# EAGLE design final_board (EAGLE 9.6.2)
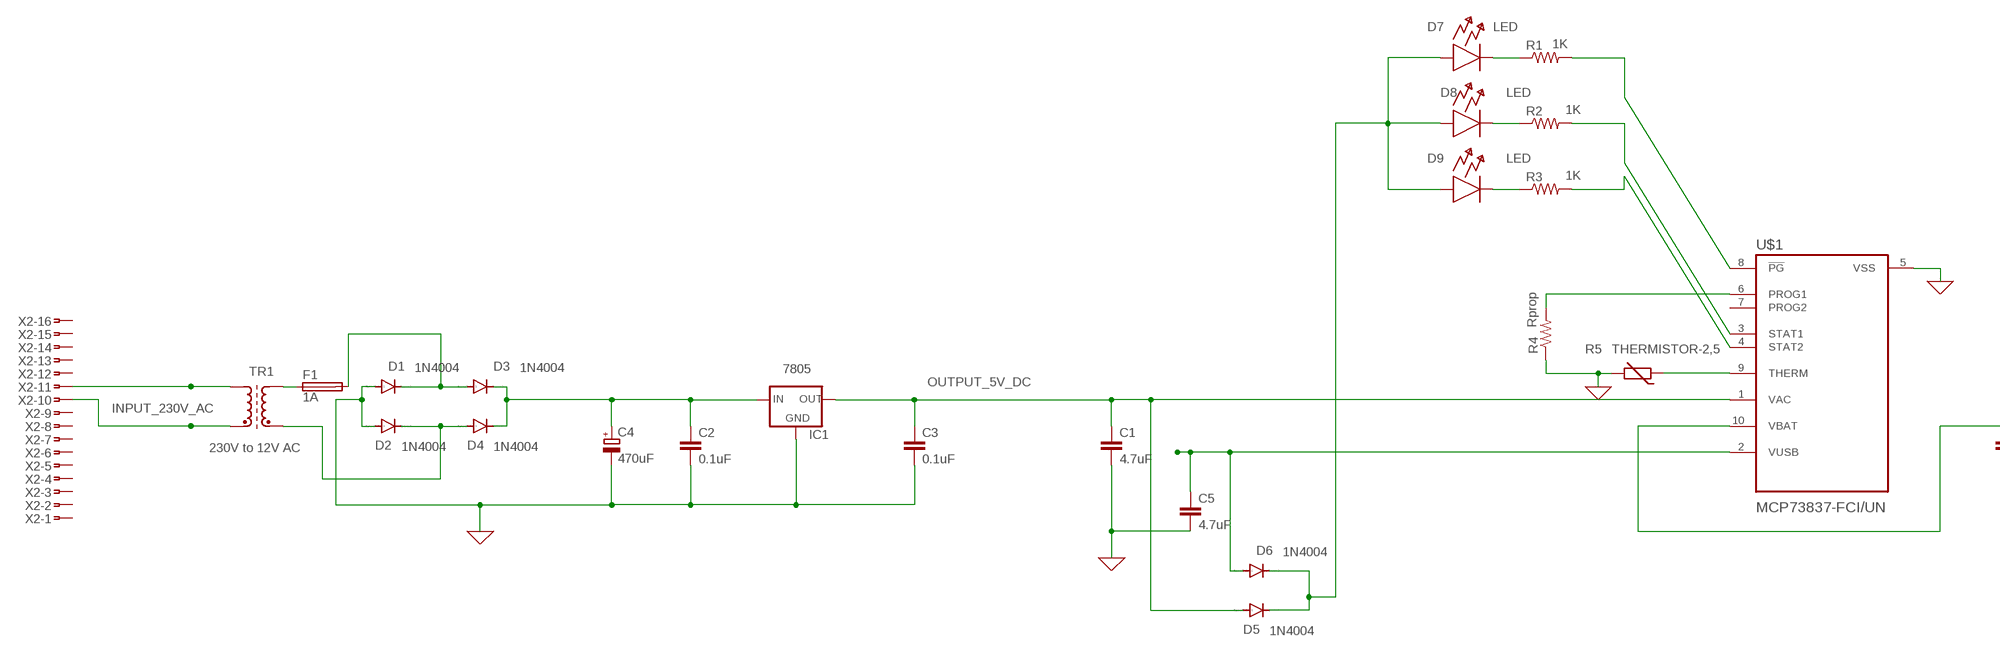
[diagram p0: schematic, sheet 1, part 1 of 2]
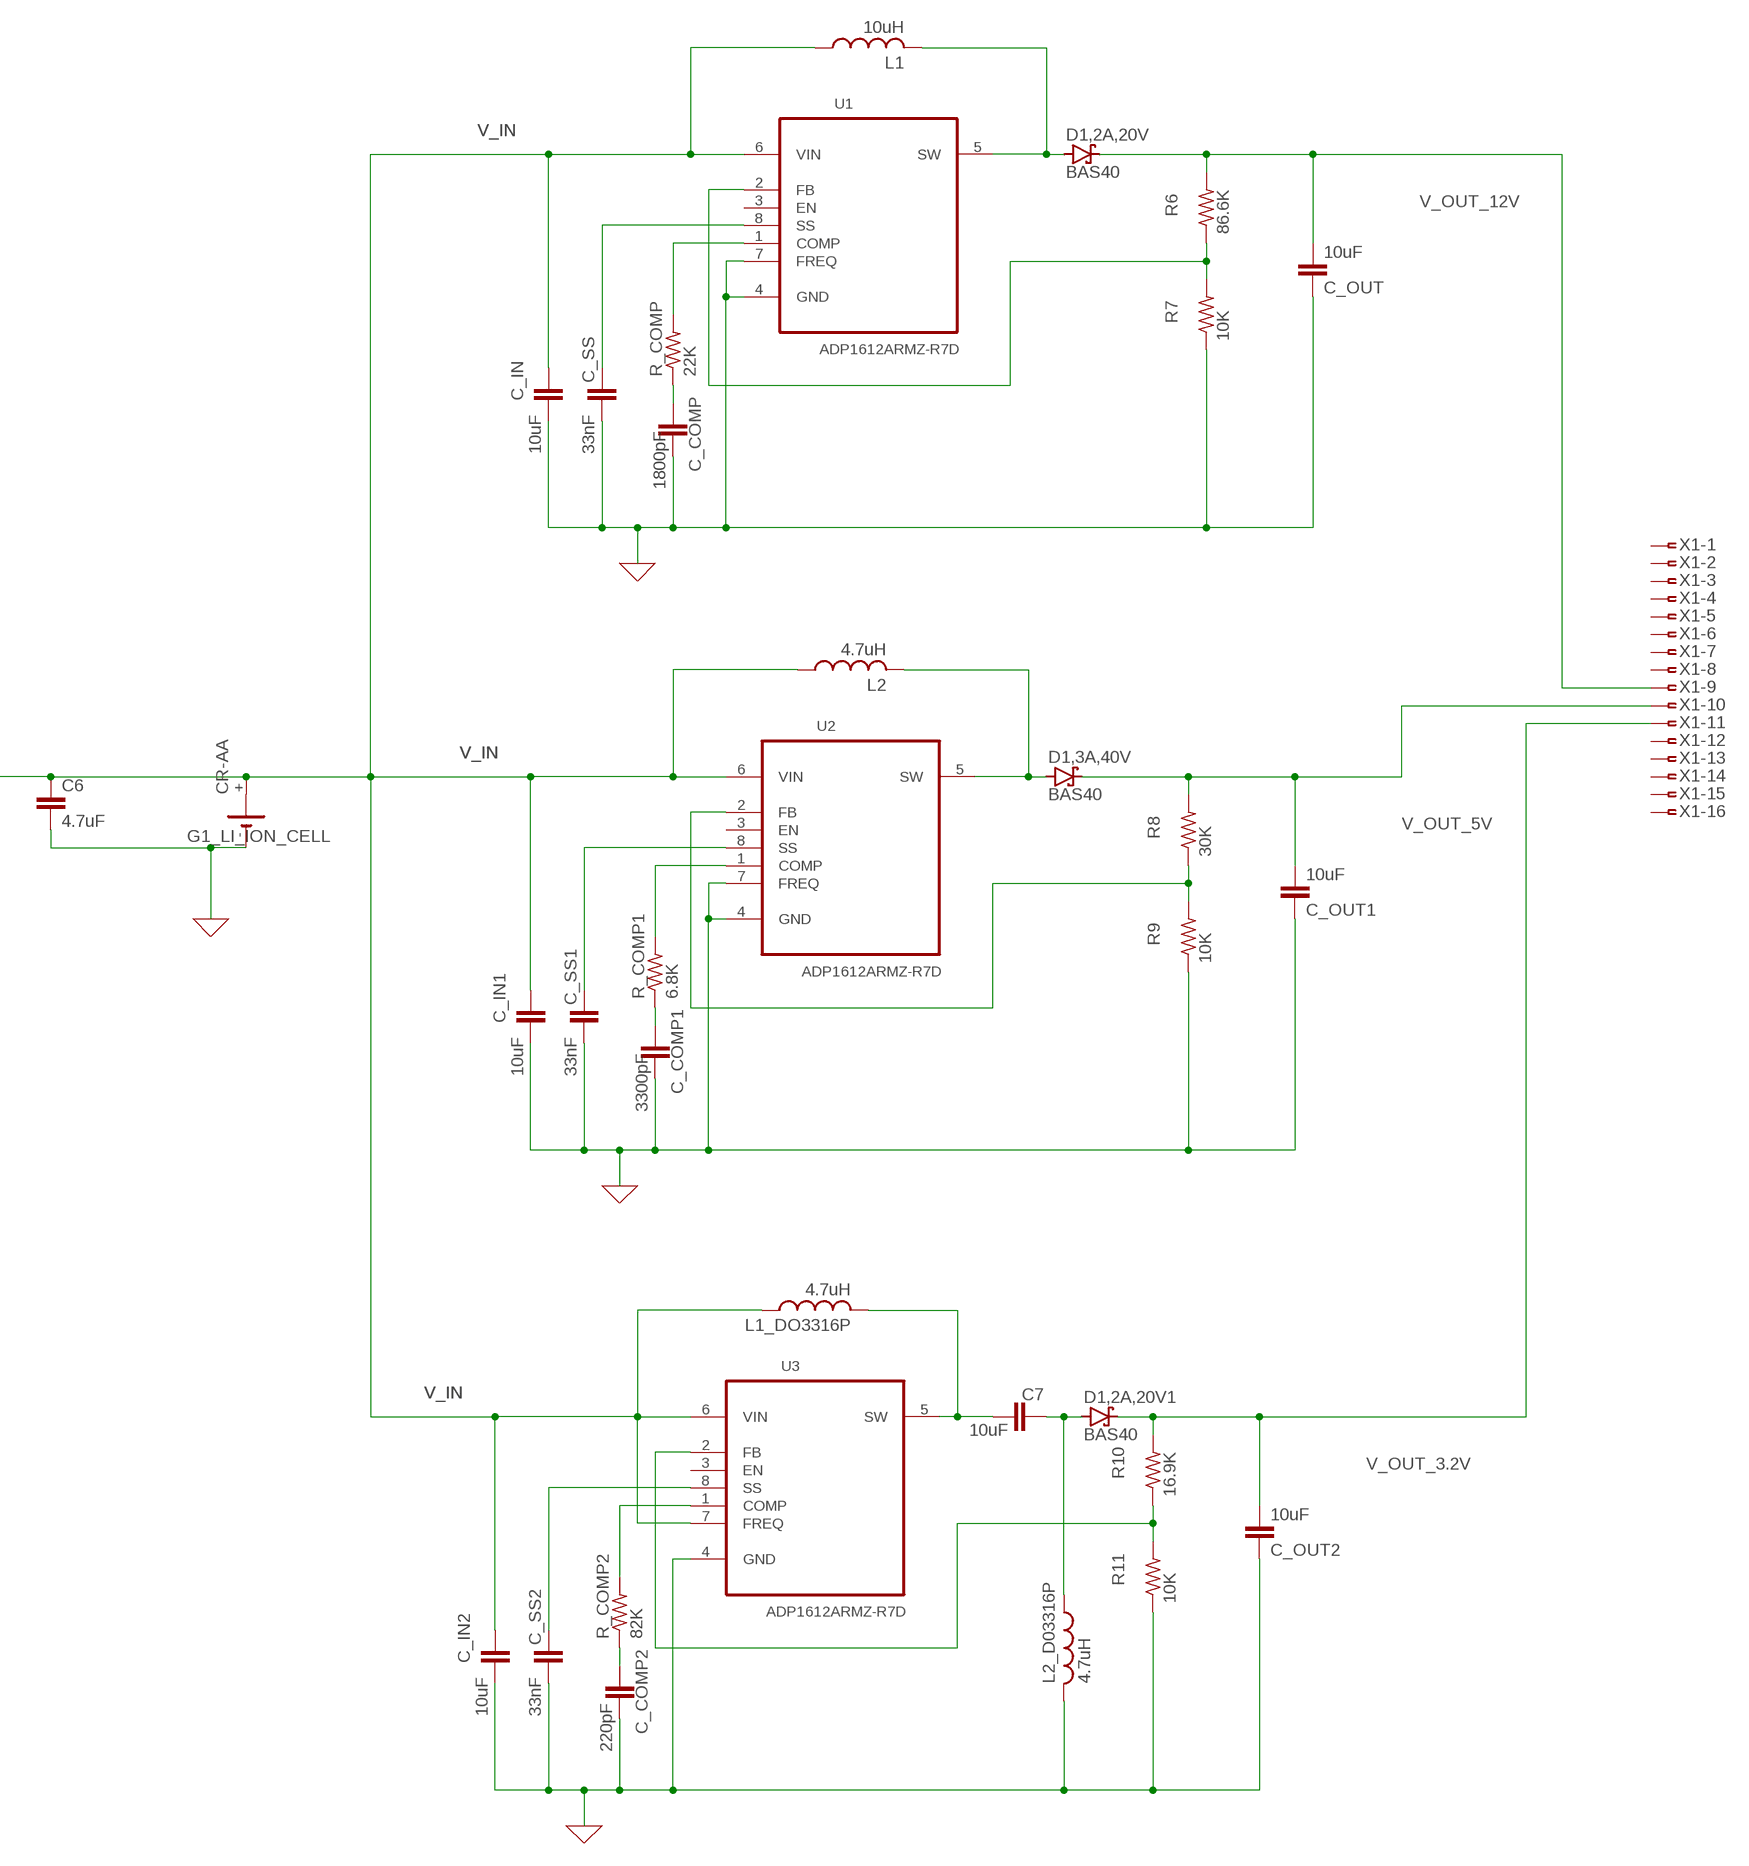
[diagram p1: schematic, sheet 1, part 2 of 2]

## Parts
C1  4.7uF  C2,5-3  [C2.5-3]
C2  0.1uF  C2,5-3  [C2.5-3]
C3  0.1uF  C2,5-3  [C2.5-3]
C4  470uF  CPOL-EU085CS-1AR  [085CS_1AR]
C5  4.7uF  C2,5-3  [C2.5-3]
C6  4.7uF  C2,5-3  [C2.5-3]
C7  10uF  C2,5-3  [C2.5-3]
C_COMP  1800pF  C2,5-3  [C2.5-3]
C_COMP1  3300pF  C2,5-3  [C2.5-3]
C_COMP2  220pF  C2,5-3  [C2.5-3]
C_IN  10uF  C2,5-3  [C2.5-3]
C_IN1  10uF  C2,5-3  [C2.5-3]
C_IN2  10uF  C2,5-3  [C2.5-3]
C_OUT  10uF  C2,5-3  [C2.5-3]
C_OUT1  10uF  C2,5-3  [C2.5-3]
C_OUT2  10uF  C2,5-3  [C2.5-3]
C_SS  33nF  C2,5-3  [C2.5-3]
C_SS1  33nF  C2,5-3  [C2.5-3]
C_SS2  33nF  C2,5-3  [C2.5-3]
D1  1N4004  [DO41-10]
D1,2A,20V  BAS40  [SOT23]
D1,2A,20V1  BAS40  [SOT23]
D1,3A,40V  BAS40  [SOT23]
D2  1N4004  [DO41-10]
D3  1N4004  [DO41-10]
D4  1N4004  [DO41-10]
D5  1N4004  [DO41-10]
D6  1N4004  [DO41-10]
D7  LED  (no package)
D8  LED  (no package)
D9  LED  (no package)
F1  1A  19559  [19559]
G1_LI_ION_CELL  CR-AA  [CRAA]
IC1  7805  78XXL  [78XXL]
L1  10uH  L-US0204/5  [0204/5]
L1_DO3316P  4.7uH  L-US0204/5  [0204/5]
L2  4.7uH  L-US0204/5  [0204/5]
L2_D03316P  4.7uH  L-US0204/5  [0204/5]
R1  1K  R-US_0204/2V  [0204V]
R2  1K  R-US_0204/2V  [0204V]
R3  1K  R-US_0204/2V  [0204V]
R4  Rprop  R-US_0204/2V  [0204V]
R5  THERMISTOR-2,5  [RS-2,5]
R6  86.6K  R-US_0204/7  [0204/7]
R7  10K  R-US_0204/7  [0204/7]
R8  30K  R-US_0204/7  [0204/7]
R9  10K  R-US_0204/7  [0204/7]
R10  16.9K  R-US_0204/7  [0204/7]
R11  10K  R-US_0204/7  [0204/7]
R_COMP  22K  R-US_0204/7  [0204/7]
R_COMP1  6.8K  R-US_0204/7  [0204/7]
R_COMP2  82K  R-US_0204/7  [0204/7]
TR1  230V to 12V AC  SM-T4  [SM-T4]
U1  ADP1612ARMZ-R7D  [SOIC-08]
U2  ADP1612ARMZ-R7D  [SOIC-08]
U3  ADP1612ARMZ-R7D  [SOIC-08]
U$1  MCP73837-FCI/UN  [SOP50P490X110-10N]
X1  FSIDE-16  [FSIDE-16]
X2  FSIDE-16  [FSIDE-16]

## Nets
0: C1.2 C2.2 C3.2 C4.- C5.2 C6.2 C_COMP1.2 C_COMP2.2 C_COMP.2 C_IN1.2 C_IN2.2 C_IN.2 C_OUT1.2 C_OUT2.2 C_OUT.2 C_SS1.2 C_SS2.2 C_SS.2 D1.A D2.A G1_LI_ION_CELL.- IC1.GND L2_D03316P.2 R4.1 R5.2 R7.1 R9.1 R11.1 U1.4(GND) U1.7(FREQ) U2.4(GND) U2.7(FREQ) U3.4(GND) U$1.5(VSS) ; supply symbol labelled GND
INPUT_230V_AC: TR1.1(A1) X2.11
N$2: TR1.2(E1) X2.10
N$3: C5.1 D6.A U$1.2(VUSB)
N$4: D1.C D3.A F1.2
N$5: D2.C D4.A TR1.4(E2)
N$6: C2.1 C4.+ D3.C D4.C IC1.IN
N$7: F1.1 TR1.5(A2)
N$8: D7.C R1.1
N$9: D8.C R2.1
N$10: D9.C R3.1
N$11: R1.2 U$1.8(!PG)
N$12: R2.2 U$1.3(STAT1)
N$13: R3.2 U$1.4(STAT2)
N$14: R5.1 U$1.9(THERM)
N$15: R4.2 U$1.6(PROG1)
N$16: D5.C D6.C D7.A D8.A D9.A
N$18: D1,2A,20V.1(A) L1.2 U1.5(SW)
N$19: C_COMP.1 R_COMP.1
N$20: R_COMP.2 U1.1(COMP)
N$21: C_SS.1 U1.8(SS)
N$22: R6.1 R7.2 U1.2(FB)
N$23: D1,3A,40V.1(A) L2.2 U2.5(SW)
N$24: C_COMP1.1 R_COMP1.1
N$25: R_COMP1.2 U2.1(COMP)
N$26: C_SS1.1 U2.8(SS)
N$27: R8.1 R9.2 U2.2(FB)
N$28: C7.1 L1_DO3316P.2 U3.5(SW)
N$29: C_COMP2.1 R_COMP2.1
N$30: R_COMP2.2 U3.1(COMP)
N$31: C_SS2.1 U3.8(SS)
N$32: R10.1 R11.2 U3.2(FB)
N$33: C7.2 D1,2A,20V1.1(A) L2_D03316P.1
OUTPUT_5V_DC: C1.1 C3.1 D5.A IC1.OUT U$1.1(VAC)
V_IN: C6.1 C_IN1.1 C_IN2.1 C_IN.1 G1_LI_ION_CELL.+ L1.1 L1_DO3316P.1 L2.1 U1.6(VIN) U2.6(VIN) U3.6(VIN) U3.7(FREQ) U$1.10(VBAT)
V_OUT_3.2V: C_OUT2.1 D1,2A,20V1.3(C) R10.2 X1.11
V_OUT_5V: C_OUT1.1 D1,3A,40V.3(C) R8.2 X1.10
V_OUT_12V: C_OUT.1 D1,2A,20V.3(C) R6.2 X1.9
Unconnected: G1_LI_ION_CELL.+@1(+) U1.3(EN) U2.3(EN) U3.3(EN) U$1.7(PROG2) X1.1 X1.2 X1.3 X1.4 X1.5 X1.6 X1.7 X1.8 X1.12 X1.13 X1.14 X1.15 X1.16 X2.1 X2.2 X2.3 X2.4 X2.5 X2.6 X2.7 X2.8 X2.9 X2.12 X2.13 X2.14 X2.15 X2.16

## Library data of the parts
C1-C3 C5-C7 C_COMP C_COMP1 C_COMP2 C_IN C_IN1 C_IN2 C_OUT C_OUT1 C_OUT2 C_SS C_SS1 C_SS2 = capacitor-wima:C: CAPACITOR naming: grid - package width
C4 = rcl:CPOL-EU: POLARIZED CAPACITOR, European symbol; SPICEPREFIX: C
D1-D6 = diode:1N4004: DIODE general purpose rectifier, 1 A
D1,2A,20V D1,2A,20V1 D1,3A,40V = diode:BAS40: Silicon Schottky Diodes General-purpose diode for high-speed switching
D7-D9 = ngspice-simulation:LED: Diode
F1 = fuse:19559: FUSE HOLDER TR5, Wickmann; MPN: 55900000001; OC_FARNELL: 9516360; OC_NEWARK: 02P0286
G1_LI_ION_CELL = battery:CR-AA: LI BATTERY Varta CRAA-SLF
IC1 = v-reg:78XXL: VOLTAGE REGULATOR
L1 L1_DO3316P L2 L2_D03316P = rcl:L-US: INDUCTOR, American symbol; SPICEPREFIX: L
R1-R4 R6-R11 R_COMP R_COMP1 R_COMP2 = rcl:R-US_: RESISTOR, American symbol; SPICEPREFIX: R
R5 = varistor:THERMISTOR: THERMISTOR
TR1 = inductor-neosid:SM-T4: TRANSFORMER SMD wideband transformer; OC_FARNELL: unknown; OC_NEWARK: unknown
U1-U3 = ADP1612ARMZ-R7:ADP1612ARMZ-R7: Step-Up PWM DC-to-DC Switching Converters; AVAILABILITY: Unavailable; DESCRIPTION: Boost, SEPIC Switching Regulator IC Positive Adjustable 1.8V 1 Output 1.4A (Switch) 8-TSSOP, 8-MSOP (0.118, 3.00mm Width); MF: Analog Devices; MP: ADP1612ARMZ-R7; PACKAGE: MSOP-8 Analog Devices; PRICE: None
U$1 = MCP73837-FCI_UN:MCP73837-FCI/UN: Check prices <https://pricing.snapeda.com/search/part/MCP73837-FCI/UN/?ref=eda>; AVAILABILITY: Warning; DESCRIPTION: Charger IC Lithium Ion/Polymer 10-MSOP; MF: Microchip; MP: MCP73837-FCI/UN; PACKAGE: MSOP-10 Microchip; PRICE: None; PURCHASE-URL: https://pricing.snapeda.com/search/part/MCP73837-FCI/UN/?ref=eda
X1 X2 = con-amp:FSIDE-16: AMP connector

## Board
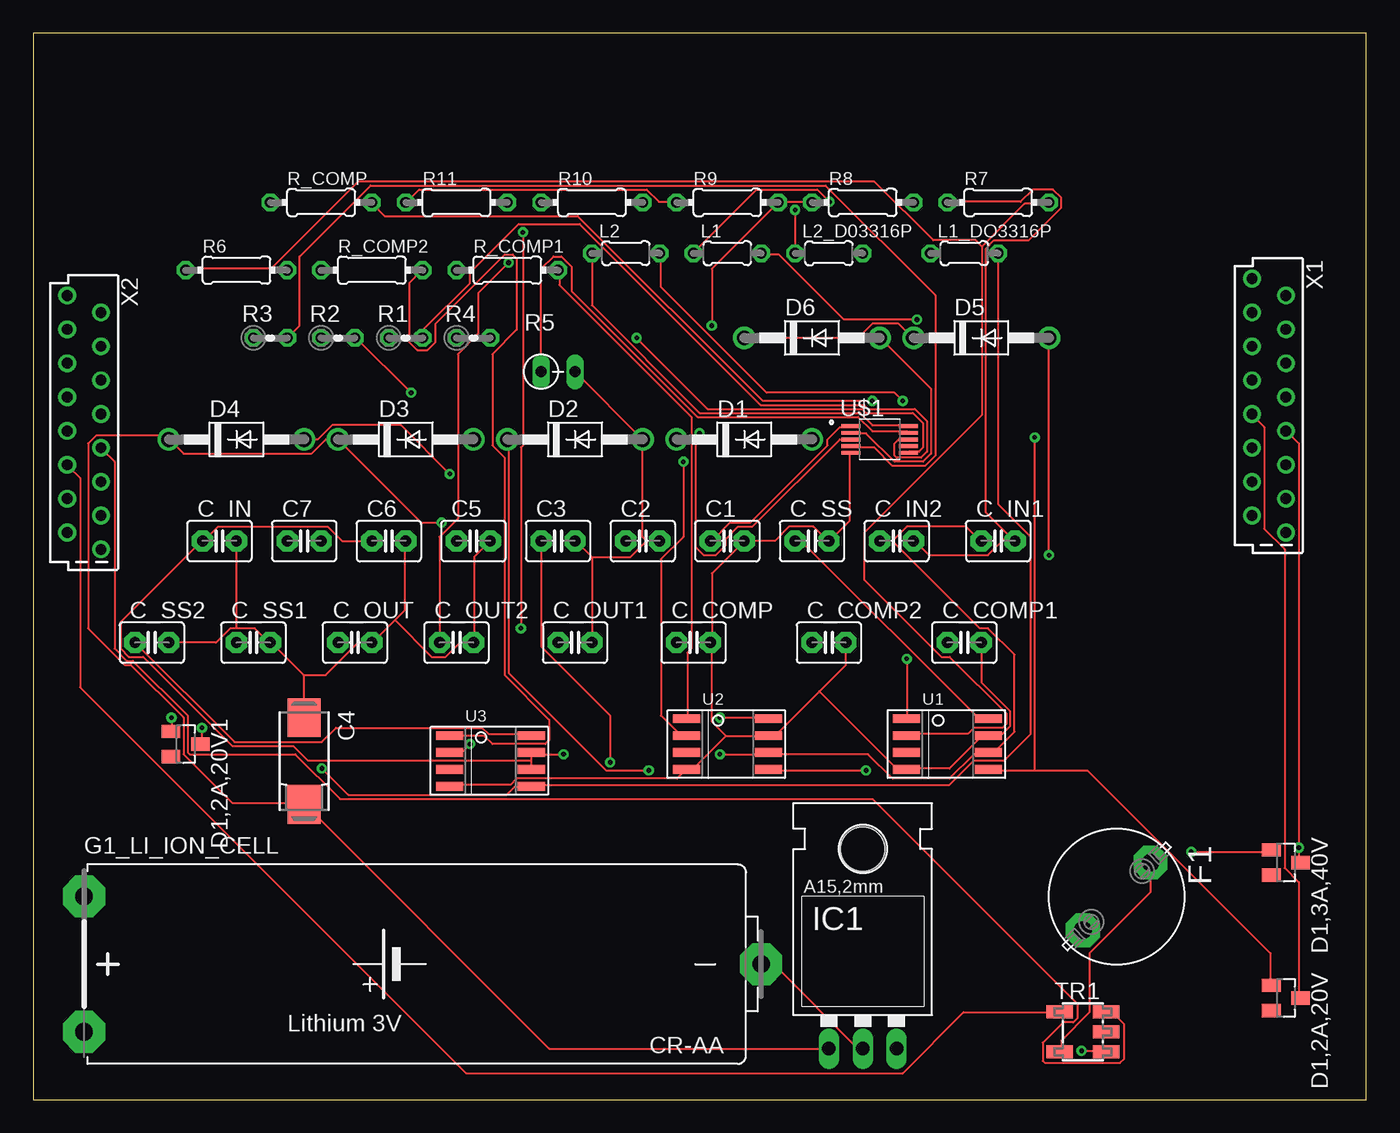
[diagram p2: board, top side]
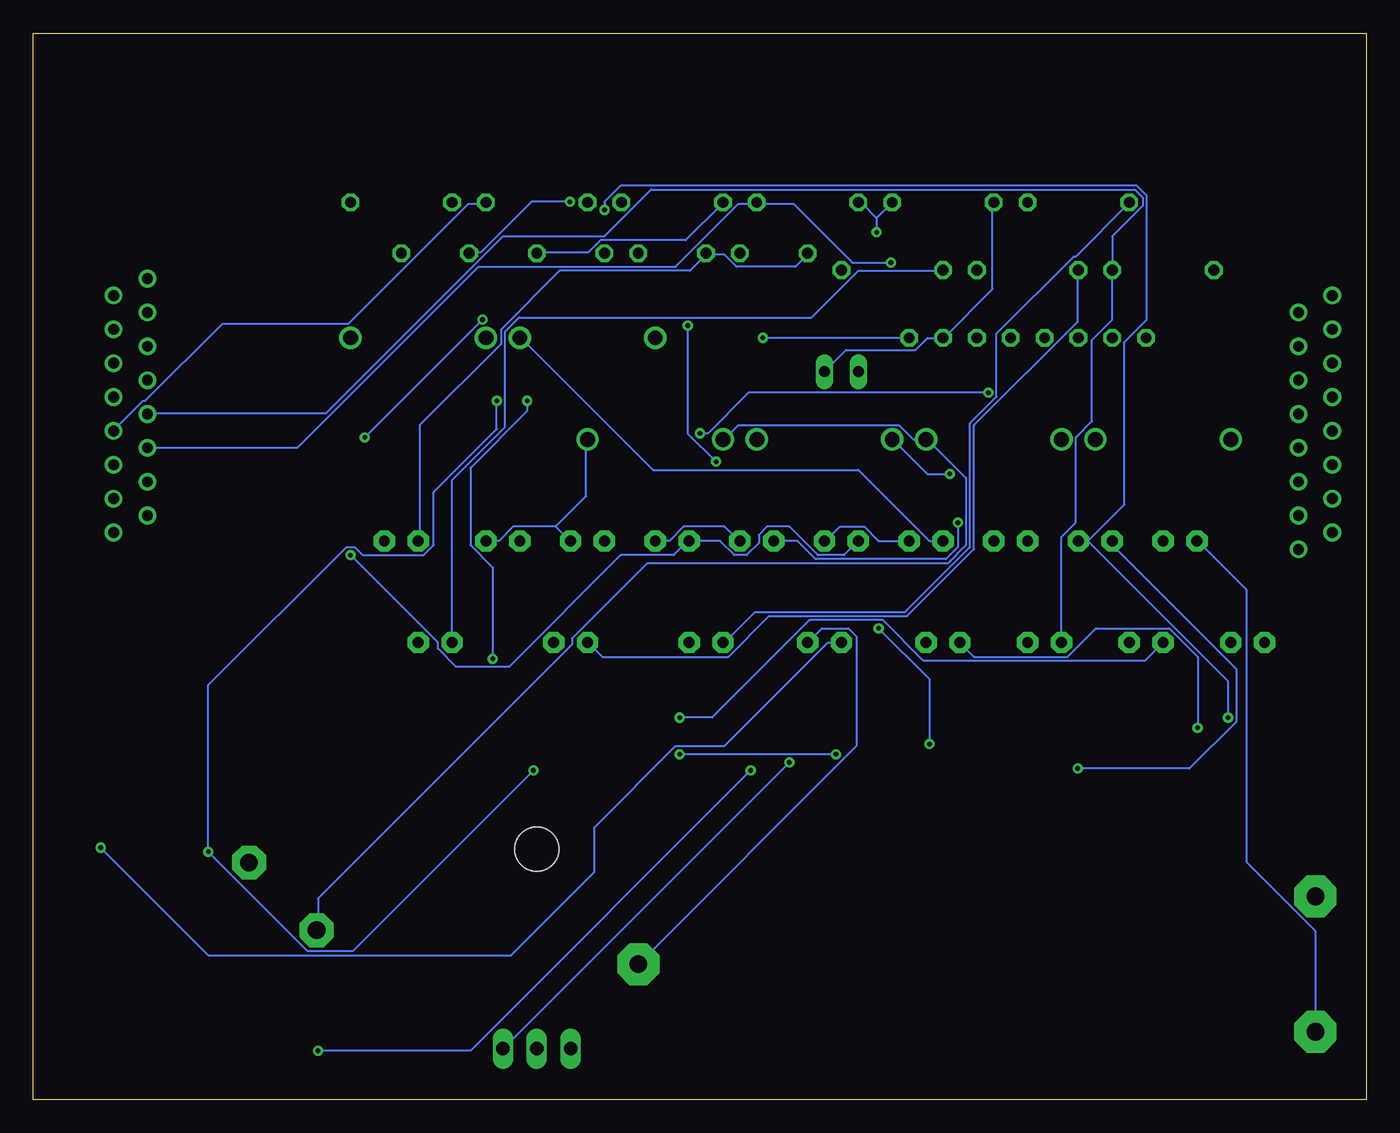
[diagram p3: board, bottom side, seen from below]

Size 100 x 80 mm. Coordinates in mm from the lower left corner, seen from the top.
Outline: 0,0 100,0 100,80 0,80 0,0
Copper layers (1*16): Top 0.035mm / dielectric 1.5mm / Bottom 0.035mm
Design rules "default": minimum track width 6mil, minimum drill 0.35mm, track to track 6mil, track to pad 6mil, pad to pad 6mil, via to via 6mil, smd to smd 6mil, copper to edge 40mil, drill to drill 6mil, minimum pad ring 10mil, minimum via ring 8mil, stop-mask expansion 4mil, vias tented up to drill 0mil, thermal gap 10mil

### Footprints (pad centres in the part's own frame; a part is rotated, then mirrored left to right if it is on the bottom)
C2.5-3 = drill 0.813 pad 1.6 octagon: 1 -1.27,0; 2 1.27,0
085CS_1AR = smd 2.9 x 2.5: + 3.25,0; - -3.25,0
DO41-10 = drill 1.118: A 5.08,0; C -5.08,0
SOT23 = smd 1 x 1.4: 1 -0.95,-1.1; 2 0.95,-1.1; 3 0,1.1
19559 = drill 1.321 pad 2.54 octagon: 1 -2.54,2.54; 2 2.54,-2.54
CRAA = drill 1.321 pad 3.15 octagon: + -25.4,-5.08; +@1 -25.4,5.08; - 25.4,0
78XXL = drill 1.016 long: GND 0,-3.81; IN -2.54,-3.81; OUT 2.54,-3.81 | hole 3.302: 0,11.176
0204/5 = drill 0.813 octagon: 1 -2.54,0; 2 2.54,0
0204V = drill 0.813 octagon: 1 -1.27,0; 2 1.27,0
RS-2,5 = drill 0.813 long: 1 -1.27,0; 2 1.27,0
0204/7 = drill 0.813 octagon: 1 -3.81,0; 2 3.81,0
SM-T4 = smd 1 x 2: 1 -1.5,-1.75; 2 -1.5,1.75; 3 0,1.75; 4 1.5,1.75; 5 1.5,-1.75
SOIC-08 = smd 0.66 x 2.032: 1 -1.905,-3.073; 2 -0.635,-3.073; 3 0.635,-3.073; 4 1.905,-3.073; 5 1.905,3.073; 6 0.635,3.073; 7 -0.635,3.073; 8 -1.905,3.073
SOP50P490X110-10N = smd 1.47 x 0.28: 1 -2.15,1; 2 -2.15,0.5; 3 -2.15,0; 4 -2.15,-0.5; 5 -2.15,-1; 6 2.15,-1; 7 2.15,-0.5; 8 2.15,0; 9 2.15,0.5; 10 2.15,1
FSIDE-16 = drill 0.813: 1 -9.525,-1.27; 2 -8.255,1.27; 3 -6.985,-1.27; 4 -5.715,1.27; 5 -4.445,-1.27; 6 -3.175,1.27; 7 -1.905,-1.27; 8 -0.635,1.27; 9 0.635,-1.27; 10 1.905,1.27; 11 3.175,-1.27; 12 4.445,1.27; 13 5.715,-1.27; 14 6.985,1.27; 15 8.255,-1.27; 16 9.525,1.27

### Placement (x,y rotation side)
C1  52.07,41.91 0 top
C2  45.72,41.91 0 top
C3  39.37,41.91 0 top
C4  20.32,25.4 270 top
C5  33.02,41.91 0 top
C6  26.67,41.91 0 top
C7  20.32,41.91 0 top
C_COMP  49.53,34.29 0 top
C_COMP1  69.85,34.29 0 top
C_COMP2  59.69,34.29 0 top
C_IN  13.97,41.91 0 top
C_IN1  72.39,41.91 0 top
C_IN2  64.77,41.91 0 top
C_OUT  24.13,34.29 0 top
C_OUT1  40.64,34.29 0 top
C_OUT2  31.75,34.29 0 top
C_SS  58.42,41.91 0 top
C_SS1  16.51,34.29 0 top
C_SS2  8.89,34.29 0 top
D1  53.34,49.53 0 top
D1,2A,20V  93.98,7.62 270 top
D1,2A,20V1  11.43,26.67 270 top
D1,3A,40V  93.98,17.78 270 top
D2  40.64,49.53 0 top
D3  27.94,49.53 0 top
D4  15.24,49.53 0 top
D5  71.12,57.15 0 top
D6  58.42,57.15 0 top
F1  81.28,15.24 270 top
G1_LI_ION_CELL  29.21,10.16 0 top
IC1  62.23,7.62 0 top
L1  52.07,63.5 0 top
L1_DO3316P  69.85,63.5 0 top
L2  44.45,63.5 0 top
L2_D03316P  59.69,63.5 0 top
R1  27.94,57.15 0 top
R2  22.86,57.15 0 top
R3  17.78,57.15 0 top
R4  33.02,57.15 0 top
R5  39.37,54.61 0 top
R6  15.24,62.23 0 top
R7  72.39,67.31 0 top
R8  62.23,67.31 0 top
R9  52.07,67.31 0 top
R10  41.91,67.31 0 top
R11  31.75,67.31 0 top
R_COMP  21.59,67.31 0 top
R_COMP1  35.56,62.23 0 top
R_COMP2  25.4,62.23 0 top
TR1  78.74,5.08 270 top
U1  68.58,26.67 270 top
U2  52.07,26.67 270 top
U3  34.29,25.4 270 top
U$1  63.5,49.53 0 top
X1  92.71,52.07 270 top
X2  3.81,50.8 270 top

### Tracks (layer width: path | path; a pad name or v marks a point on that pad's centre or on a via)
0
  Top 0.152: R5.2 D2.A 45.72,42.22 46.02,41.91 | R9.1 48.16,67.36 46.94,67.36 46.02,68.28 28.96,68.28 28.04,67.36 R11.1 | C_COMP1.2 71.17,34.29 71.17,31.24 73.3,29.11 73.3,28.04 72.69,27.43 71.78,27.43 U1.7 71.63,27.28 71.17,27.28 68.73,24.84 65.53,24.84 U1.4 65.38,24.84 64.77,24.84 58.98,30.63 | U3.4 31.24,23.62 35.81,23.62 36.27,24.08 48.31,24.08 U2.4 49.07,24.84 49.53,24.84 51.97,27.28 | 51.97,27.28 55.02,27.28 U2.7 55.17,27.43 55.78,27.43 58.98,30.63 | 50.9,34.29 50.9,28.35 51.97,27.28 | C_COMP2.2 60.96,32.61 58.98,30.63 | 20.27,31.85 20.27,28.65 C4.- | 20.27,31.85 17.83,34.29 C_SS1.2 17.68,34.29 16.61,35.36 15.24,35.36 | C_SS2.2 13.72,34.29 14.78,35.36 15.24,35.36 | 20.27,31.85 21.95,31.85 24.38,34.29 C_OUT.2 25.45,34.29 27.13,35.97 | 15.24,35.36 C_IN.2 | 27.13,35.97 27.89,36.73 27.89,41.91 C6.2 | 27.13,35.97 29.87,33.22 30.94,33.22 32,34.29 C_OUT2.2 33.07,34.29 33.07,40.69 C5.2 | 73.15,42.37 73.61,41.91 C_IN1.2 73.15,42.37 | 73.15,42.37 71.48,44.04 71.48,63.86 72.08,64.47 74.68,64.47 77.11,66.9 77.11,67.67 76.5,68.28 74.98,68.28 74.07,67.36 68.58,67.36 R7.1 | U$1.5 61.27,48.46 61.27,43.43 59.74,41.91 C_SS.2 59.59,41.91 58.52,42.98 56.69,42.98 55.63,41.91 C1.2 50.9,39.47 50.9,34.29 | IC1.GND 61.87,3.81 55.63,10.06 54.71,10.06 G1_LI_ION_CELL.- | 41.91,40.69 C_OUT1.2 | 41.91,40.69 40.69,41.91 C3.2 | 46.02,41.91 C2.2 | 46.02,41.91 44.81,40.69 41.91,40.69 | 73.15,42.37 71.63,40.84 67.21,40.84 66.14,41.91 C_IN2.2 | 50.9,34.29 C_COMP.2
  Bottom 0.152: L2_D03316P.2 62.18,63.55 58.37,63.55 57.45,64.47 51.05,64.47 48.31,67.21 R9.1 | R5.2 39.01,56.24 33.83,56.24 32.92,57.15 R4.1 31.7,57.15 28.04,60.81 28.04,67.21 R11.1 | C_IN2.2 65.08,41.91 64.01,42.98 60.81,42.98 | 60.81,42.98 59.74,41.91 C_SS.2 | 60.81,42.98 58.52,45.26 58.52,49.53 D1.A | C5.2 36.58,41.91 37.64,42.98 39.47,42.98 40.54,41.91 C3.2 | G1_LI_ION_CELL.- 38.25,26.52 38.25,34.75 38.86,35.36 40.84,35.36 C_OUT1.2 | C1.2 52.27,41.91 51.21,42.98 48.16,42.98 47.09,41.91 C2.2
INPUT_230V_AC
  Top 0.152: TR1.1 76.96,6.55 69.8,6.55 65.23,1.98 32.46,1.98 3.5,30.94 3.5,46.63 2.59,47.55 X2.11
N$2
  Top 0.152: TR1.2 80.62,6.55 80.92,6.55 81.84,5.64 81.84,3.05 81.53,2.74 75.89,2.74 75.74,2.9 75.74,4.27 77.27,5.79 78.03,5.79 78.33,6.1 78.33,7.16 62.94,22.55 23.01,22.55 19.66,25.91 11.73,25.91 11.58,26.06 11.58,28.8 7.47,32.92 7.01,32.92 6.1,33.83 6.1,47.85 5.18,48.77 X2.10
N$3
  Top 0.152: U$1.2 61.42,49.99 62.48,49.99 64.62,47.85 66.75,47.85 67.36,48.46 67.36,53.34 63.55,57.15 D6.A
  Bottom 0.152: C5.1 32.77,41.91 38.1,47.24 53.49,47.24 63.4,57.15 D6.A
N$4
  Bottom 0.152: D1.C 48.16,49.53 47.09,50.6 35.05,50.6 33.98,49.53 D3.A 32.92,49.53 30.02,46.63 30.02,41.6 31.39,40.23 53.95,40.23 59.59,34.59 59.59,34.14 78.64,15.09 78.64,12.8 F1.2
N$5  (via drill 0.35)
  Top 0.152: v78.64,3.66 80.47,3.66 TR1.4 | v46.18,24.69 42.98,24.69 35.66,32 35.66,49.53 D2.C | D4.A 21.34,49.53 22.4,50.6 27.58,50.6 v31.24,46.94
  Bottom 0.152: v78.64,3.66 67.21,3.66 v46.18,24.69 | v31.24,46.94 32.92,46.94 35.51,49.53 D2.C
N$6  (via drill 0.35)
  Top 0.152: v30.63,43.28 29.11,43.28 D3.C 21.95,49.53 20.88,48.46 11.28,48.46 10.21,49.53 D4.C 10.06,49.53 9.75,49.84 4.72,49.84 4.12,49.23 4.12,35.36 6.86,32.61 7.32,32.61 11.28,28.65 11.28,25.91 14.94,22.25 20.27,22.25 C4.+ 20.42,22.1 38.71,3.81 IC1.IN
  Bottom 0.152: C2.1 42.67,41.91 41.3,40.54 31.55,40.54 30.63,41.45 v30.63,43.28
N$7
  Top 0.152: F1.1 83.82,15.54 79.25,10.97 79.25,6.55 77.11,4.42 77.11,3.66 TR1.5
N$11
  Top 0.152: U$1.8 64.92,49.53 64.62,49.23 64.62,48.31 64.77,48.16 66.6,48.16 67.06,48.62 67.06,50.9 66.14,51.82 62.64,51.82 62.33,52.12 54.56,52.12 41,65.68 36.42,65.68 32.77,62.03 32.77,61.27 29.26,57.76 29.26,57.15 R1.2
N$12  (via drill 0.35)
  Top 0.152: U$1.3 60.5,49.53 53.95,42.98 52.88,42.98 51.97,42.06 51.97,41.6 51.21,40.84 50.29,40.84 49.68,41.45 49.68,49.68 v49.99,49.99 | v28.35,53.03 24.23,57.15 R2.2
  Bottom 0.152: v49.99,49.99 49.38,49.99 46.33,53.03 v28.35,53.03
N$13
  Top 0.152: R3.2 19.96,58.06 19.96,63.25 25.3,68.58 59.44,68.58 67.67,60.35 67.67,48.31 66.9,47.55 64.47,47.55 63.09,48.92 61.42,48.92 U$1.4
N$14
  Top 0.152: R5.1 38.1,62.33 39.01,63.25 39.62,63.25 40.39,62.48 40.39,60.66 49.84,51.21 61.87,51.21 62.94,50.14 65.53,50.14 U$1.9
N$15  (via drill 0.35)
  Top 0.152: v45.26,57.15 50.6,51.82 62.18,51.82 62.48,51.51 65.99,51.51 66.75,50.75 66.75,48.92 66.45,48.62 65.68,48.62 U$1.6
  Bottom 0.152: R4.2 v45.26,57.15
N$16
  Top 0.152: D6.C 61.87,57.15 62.94,58.22 64.92,58.22 65.99,57.15 D5.C
N$18  (via drill 0.35)
  Top 0.152: 75.13,24.69 71.78,24.69 U1.5 | 75.13,24.69 79.1,24.69 92.81,10.97 92.81,8.69 D1,2A,20V.1 | v66.29,58.52 60.81,58.52 55.93,63.4 54.71,63.4 L1.2 | 75.13,24.69 v75.13,49.68
  Bottom 0.152: v75.13,49.68 v66.29,58.52
N$19
  Bottom 0.152: R_COMP.1 17.83,67.21 21.79,63.25 21.95,63.25 27.74,57.45 27.74,52.73 29.72,50.75 29.72,41.45 34.59,36.58 45.87,36.58 48.16,34.29 C_COMP.1
N$20  (via drill 0.35)
  Top 0.152: v65.53,33.07 65.53,28.65 U1.1 | v62.94,52.43 54.71,52.43 40.84,66.29 26.36,66.29 25.45,67.21 R_COMP.2
  Bottom 0.152: v65.53,33.07 65.53,39.93 67.21,41.6 67.21,47.4 62.94,51.66 v62.94,52.43
N$21
  Top 0.152: C_SS.1 57.61,41.91 70.87,28.65 71.63,28.65 U1.8
N$22
  Top 0.152: 71.17,64.01 71.17,51.36 62.33,42.52 62.33,39.01 68.12,33.22 68.73,33.22 73,28.96 73,28.19 72.69,27.89 70.56,27.89 70.1,27.43 65.53,27.43 U1.2 | 71.17,64.01 74.37,67.21 76.2,67.21 R7.2 | 71.17,64.01 70.71,64.47 67.51,64.47 63.09,68.89 24.38,68.89 17.83,62.33 11.43,62.33 R6.1
N$23  (via drill 0.35)
  Top 0.152: v86.87,18.59 92.81,18.59 D1,3A,40V.1 | v62.48,24.69 55.17,24.69 U2.5 | v65.23,52.43 64.62,53.03 55.02,53.03 47.09,60.96 47.09,63.4 L2.2
  Bottom 0.152: v62.48,24.69 76.05,11.12 79.4,11.12 v86.87,18.59 86.87,31.09 76.5,41.45 75.89,41.45 75.29,40.84 70.71,40.84 69.95,41.6 69.95,45.57 65.23,50.29 v65.23,52.43
N$24
  Bottom 0.152: C_COMP1.1 68.58,46.48 64.62,50.44 64.62,57.61 63.55,58.67 41.6,58.67 38.1,62.18 31.85,62.18 R_COMP1.1
N$25
  Top 0.152: U2.1 49.07,28.65 49.07,33.53 49.38,33.83 49.38,51.21 39.47,61.11 39.47,62.18 R_COMP1.2
N$26  (via drill 0.35)
  Top 0.152: v51.51,28.65 55.02,28.65 U2.8
  Bottom 0.152: v51.51,28.65 49.07,28.65 41.76,35.97 36.27,35.97 33.22,32.92 16.61,32.92 C_SS1.1
N$27  (via drill 0.35)
  Top 0.152: v48.77,47.85 48.77,42.22 47.09,40.54 47.09,28.8 48.46,27.43 48.92,27.43 U2.2 | v50.9,58.06 50.9,62.33 R9.2 55.93,67.36 58.37,67.36 R8.1
  Bottom 0.152: v48.77,47.85 50.9,49.99 v50.9,58.06
N$28  (via drill 0.35)
  Top 0.152: v21.64,24.84 23.62,22.86 35.51,22.86 36.12,23.47 37.34,23.47 U3.5 37.49,23.62 68.73,23.62 70.56,25.45 72.85,25.45 74.83,27.43 74.83,42.22 72.39,44.65 L1_DO3316P.2
  Bottom 0.152: v21.64,24.84 13.26,24.84 9.75,28.35 9.75,32.31 19.05,41.6 C7.1
N$29
  Bottom 0.152: R_COMP2.1 21.64,62.18 21.64,58.37 29.41,50.6 29.41,41.3 34.44,36.27 44.81,36.27 47.85,33.22 57.3,33.22 58.37,34.29 C_COMP2.1
N$30
  Top 0.152: U3.1 31.24,27.28 33.83,27.28 34.44,26.67 38.41,26.67 38.71,26.98 38.71,28.5 35.36,31.85 35.36,48.16 34.44,49.07 34.44,55.93 36.27,57.76 36.27,63.09 35.97,63.4 35.36,63.4 30.18,58.22 30.18,56.84 29.57,56.24 28.8,56.24 28.19,56.84 28.19,61.27 29.11,62.18 R_COMP2.2
N$31
  Top 0.152: C_SS2.1 15.09,26.82 21.64,26.82 22.71,27.89 33.68,27.89 34.14,27.43 37.34,27.43 U3.8
N$32  (via drill 0.35)
  Top 0.152: v32.77,26.67 32.16,26.06 31.24,26.06 U3.2 | v36.58,35.36 36.58,48.92 36.73,49.07 v36.73,65.08
  Bottom 0.152: v32.77,26.67 32.77,31.55 v36.58,35.36 | 36.73,66.14 v36.73,65.08 | R11.2 36.73,66.14 | 36.73,66.14 37.8,67.21 38.1,67.21 R10.1
N$33  (via drill 0.35)
  Top 0.152: v10.36,28.65 10.36,27.74 D1,2A,20V1.1 | v57.15,66.75 L2_D03316P.1
  Bottom 0.152: v10.36,28.65 10.36,31.39 20.88,41.91 | 20.88,41.91 C7.2 21.49,41.91 | v57.15,66.75 57.15,67.36 55.93,68.58 17.22,68.58 16.46,67.82 16.46,58.52 18.14,56.84 18.14,44.65 20.88,41.91
OUTPUT_5V_DC  (via drill 0.35)
  Top 0.152: U$1.1 61.27,50.44 60.5,50.44 59.59,49.53 59.59,49.07 53.8,43.28 52.27,43.28 50.9,41.91 C1.1 | v76.2,40.84 D5.A | v43.28,25.3 43.28,28.8 38.1,33.98 C3.1
  Bottom 0.152: v76.2,40.84 69.65,34.29 69.65,33.83 68.28,32.46 64.31,32.46 55.93,40.84 51.97,40.84 50.9,41.91 C1.1 48.46,41.91 47.4,40.84 46.48,40.84 45.57,41.76 45.57,42.37 44.96,42.98 43.28,42.98 41.15,40.84 39.17,40.84 C3.1 | v43.28,25.3 IC1.OUT
V_IN  (via drill 0.35)
  Top 0.152: 64.47,41.91 C_IN2.1 | 64.47,41.91 65.53,42.98 69.95,42.98 71.02,41.91 C_IN1.1 | 64.47,41.91 71.02,35.36 71.63,35.36 73.61,33.38 73.61,27.58 72.08,26.06 71.78,26.06 U1.6 71.63,25.91 70.56,25.91 68.73,24.08 64.47,24.08 62.64,25.91 55.17,25.91 U2.6 55.02,25.91 v51.51,25.91 | L2.1 41.91,59.59 49.99,51.51 62.03,51.51 62.94,50.6 65.53,50.6 U$1.10 | v59.74,67.36 58.83,68.28 54.25,68.28 49.53,63.55 L1.1 | 37.34,25.45 37.34,25.91 U3.7 37.49,25.91 v39.78,25.91 | 37.34,25.45 37.34,24.84 U3.6 | 37.34,25.45 20.57,25.45 19.51,26.52 14.94,26.52 8.23,33.22 7.16,33.22 6.55,33.83 6.55,35.81 12.65,41.91 C_IN.1 12.8,41.91 13.87,42.98 22.1,42.98 23.16,41.91 C6.1
  Bottom 0.152: 49.53,63.4 48.16,63.4 47.24,62.48 42.82,62.48 41.91,63.4 L2.1 | v59.74,67.36 62.64,67.36 66.45,63.55 67.21,63.55 L1_DO3316P.1 | 49.53,63.4 50.75,62.18 60.5,62.18 64.92,57.76 64.92,56.69 71.02,50.6 71.02,41.91 C_IN1.1 | 49.53,63.4 L1.1 | G1_LI_ION_CELL.+ 3.81,12.65 8.99,17.83 8.99,38.25 12.65,41.91 C_IN.1 | v39.78,25.91 v51.51,25.91
V_OUT_3.2V  (via drill 0.35)
  Top 0.152: v12.65,27.89 12.65,26.67 D1,2A,20V1.3 | C_OUT2.1 30.48,42.22 31.85,43.59 31.85,55.93 33.38,57.45 33.38,60.5 v35.66,62.79
  Bottom 0.152: v12.65,27.89 12.65,33.22 14.78,35.36 20.27,35.36 22.4,33.22 29.41,33.22 C_OUT2.1 | 45.72,67.21 47.09,67.21 51.82,62.48 66.6,62.48 80.16,48.92 91.44,48.92 X1.11 | v35.66,62.79 38.56,62.79 42.98,67.21 45.72,67.21 | 45.72,67.21 R10.2
V_OUT_5V  (via drill 0.35)
  Top 0.152: D1,3A,40V.3 94.94,17.83 v94.94,18.9 94.94,49.23 94.03,50.14 X1.10
  Bottom 0.152: R8.2 66.14,67.21 67.36,67.21 76.35,58.22 85.8,58.22 91.59,52.43 91.75,52.43 93.88,50.29 X1.10 | C_OUT1.1 40.39,34.29 48.16,26.52 51.82,26.52 57.91,20.42 57.91,17.07 64.16,10.82 86.87,10.82 v94.94,18.9
V_OUT_12V
  Top 0.152: D1,2A,20V.3 94.94,7.62 94.94,16.31 93.88,17.37 93.88,41.3 92.35,42.82 92.35,50.44 91.44,51.36 X1.9
  Bottom 0.152: C_OUT.1 22.86,42.22 21.79,43.28 21.79,49.68 20.57,50.9 20.57,57 19.05,58.52 R6.2 19.05,64.77 16.76,67.06 16.76,67.67 17.37,68.28 53.65,68.28 57.15,64.77 64.77,64.77 78.03,51.51 91.44,51.51 X1.9